# EAGLE schematic IgorBrain (EAGLE 7.5.0)
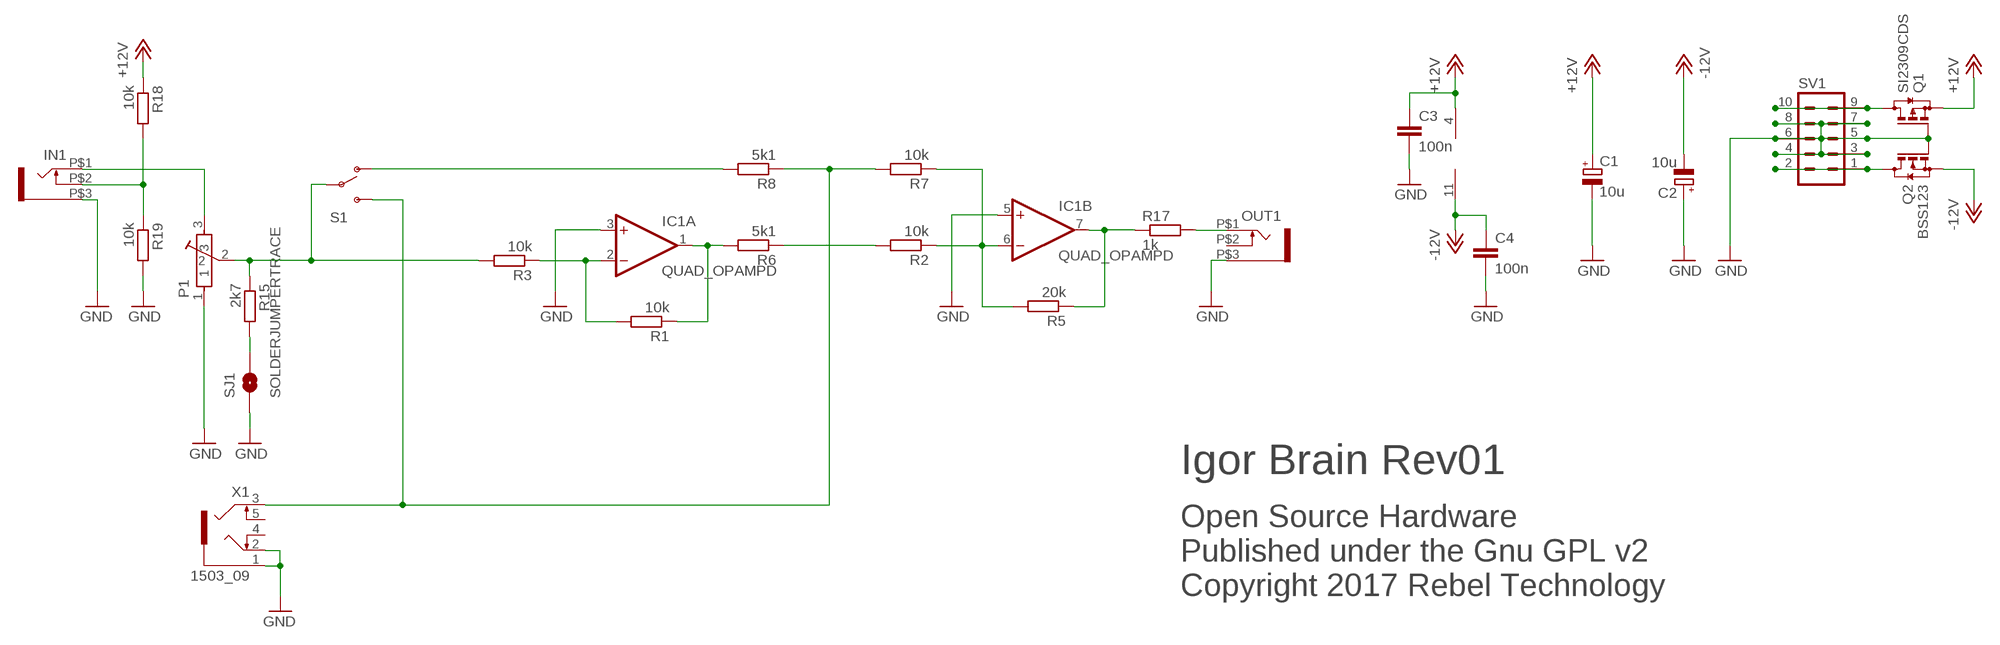
[diagram p0: schematic, sheet 1]

## Parts
C1  10u  CPOL-EU153CLV-0505  [153CLV-0505]
C2  10u  CPOL-EU153CLV-0505  [153CLV-0505]
C3  100n  C-EUC0603  [C0603]
C4  100n  C-EUC0603  [C0603]
IC1  QUAD_OPAMPD  [SO14]
IN1  JACK-UJ-3502-R  [UJ-3502-R]
OUT1  JACK-UJ-3502-R  [UJ-3502-R]
P1  10k lin  POT-BOURNS-PTD901  [POT-BOURNS-PTD901]
Q1  SI2309CDS  BSS84  [SOT23]
Q2  BSS123  [SOT23]
R1  10k  R-EU_0603  [0603]
R2  10k  R-EU_0603  [0603]
R3  10k  R-EU_0603  [0603]
R5  20k  R-EU_0603  [0603]
R6  5k1  R-EU_0603  [0603]
R7  10k  R-EU_0603  [0603]
R8  5k1  R-EU_0603  [0603]
R15  2k7  R-EU_0603  [0603]
R17  1k  R-EU_0603  [0603]
R18  10k  R-EU_0603  [0603]
R19  10k  R-EU_0603  [0603]
S1  SWITCH-SPST  [SWITCH-SPDT-SALECOM-T8014]
SJ1  SOLDERJUMPERTRACE  [SJ_2S-TRACE]
SV1  MA05-2  [MA05-2]
X1  1503_09  [1503_09]

## Nets
+12V: C1.+ C3.1 IC1.4(P:V+) Q1.2(S) R18.1
-12V: C2.- C4.1 IC1.11(P:V-) Q2.2(S)
GND: C1.- C2.+ C3.2 C4.2 IC1.3(A:+IN) IC1.5(B:+IN) IN1.P$3(SLEEVE) OUT1.P$3(SLEEVE) P1.1 Q1.1(G) Q2.1(G) R19.2 SJ1.1 SV1.3 SV1.4 SV1.5 SV1.6 SV1.7 SV1.8 X1.1 X1.2
N$1: Q2.3(D) SV1.1 SV1.2
N$2: R7.2 R8.1 S1.3(S) X1.3
N$3: P1.2 R3.2 R15.1 S1.2(P)
N$4: IC1.7(B:OUT) R5.1 R17.1
N$5: IC1.1(A:OUT) R1.1 R6.2
N$6: R2.2 R6.1
N$7: R8.2 S1.1(O)
N$10: R15.2 SJ1.2
N$11: IC1.6(B:-IN) R2.1 R5.2 R7.1
N$14: Q1.3(D) SV1.9 SV1.10
N$18: OUT1.P$1(TIP) R17.2
N$19: IN1.P$2(SW) R18.2 R19.1
N$20: IC1.2(A:-IN) R1.2 R3.1
N$21: IN1.P$1(TIP) P1.3
Unconnected: IC1.8(C:OUT) IC1.9(C:-IN) IC1.10(C:+IN) IC1.12(D:+IN) IC1.13(D:-IN) IC1.14(D:OUT) OUT1.P$2(SW) X1.4 X1.5

## Notes on the sheet
- Igor Brain Rev01
- Open Source Hardware
  Published under the Gnu GPL v2
  Copyright 2017 Rebel Technology

## Library data of the parts
C1 C2 = rcl:CPOL-EU: POLARIZED CAPACITOR, European symbol
C3 C4 = Rebel:C-EU: CAPACITOR, European symbol
IC1 = adafruit:QUAD_OPAMP: OP AMP Standard quad package
IN1 OUT1 = Rebel:JACK-UJ-3502-R
P1 = Rebel:POT-BOURNS-PTD901
Q1 = transistor-small-signal:BSS84: P-CHANNEL MOS FET
Q2 = transistor-small-signal:BSS123: N-CHANNEL MOS FET
R1-R3 R5-R8 R15 R17-R19 = Rebel:R-EU_: RESISTOR, European symbol
S1 = Rebel:SWITCH-SPST: SPST Switch Simple slide switch. Spark Fun Electronics SKU : COM-00102
SJ1 = SparkFun:SOLDERJUMPER: Solder Jumper Standard SMD solder jumper. Used to automate production. Two varients : Normally Open and Normally Closed are the same, but have different paste layers. NC will have a large amount of paste and should jumper during reflow.
SV1 = con-lstb:MA05-2: PIN HEADER; OC_FARNELL: unknown; OC_NEWARK: unknown
X1 = con-lumberg:1503_09: Jack connectors according to JISC 6560, 3.5 mm Klinkeneinbaukupplung nach JISC 6560, 3,5 mm, 3-polig/ stereo, abgewinkelte Ausführung, mit 2 Öffnern und Lötaugen, für Leiterplatten Rückseitenmontage Source: http://www.lumberg.com/Produkte/PDFs/1503_09.pdf; OC_FARNELL: 1243244; OC_NEWARK: unknown